# Altium schematic sheet AM-IO.SchDoc
size A
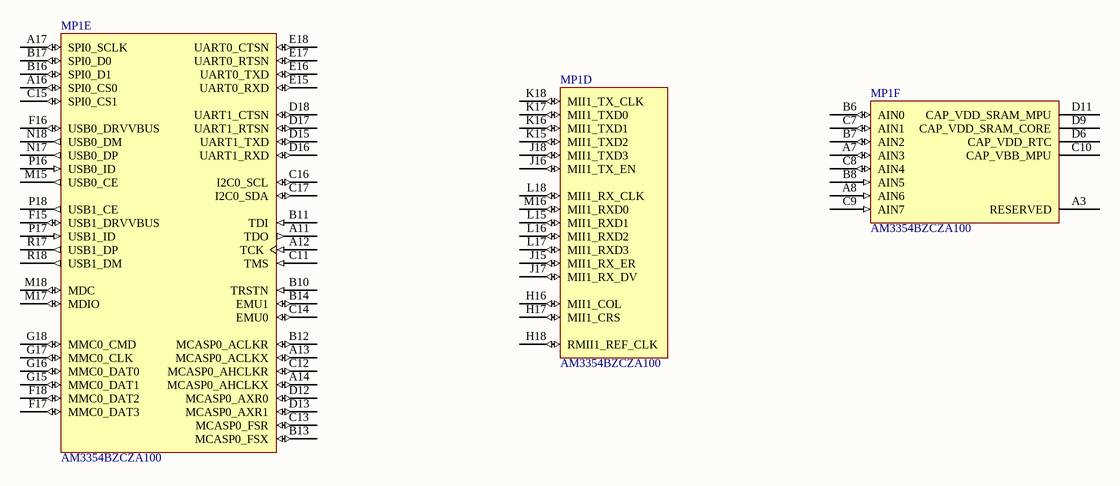
[diagram p0: AM-IO.SchDoc]

## Parts
MP1  AM3354BZCZA100  [TI-ZCZ324]  (parts D,E,F of 9)

## Nets

Not connected (* = marked no-connect by the designer): MP1 A3(RESERVED) A7(AIN3) A8(AIN6) A11(TDO) A12(TCK) A13(MCASP0_ACLKX) A14(MCASP0_AHCLKX) A16(SPI0_CS0) A17(SPI0_SCLK) B6(AIN0) B7(AIN2) B8(AIN5) B10(TRSTN) B11(TDI) B12(MCASP0_ACLKR) B13(MCASP0_FSX) B14(EMU1) B16(SPI0_D1) B17(SPI0_D0) C7(AIN1) C8(AIN4) C9(AIN7) C10(CAP_VBB_MPU) C11(TMS) C12(MCASP0_AHCLKR) C13(MCASP0_FSR) C14(EMU0) C15(SPI0_CS1) C16(I2C0_SCL) C17(I2C0_SDA) D6(CAP_VDD_RTC) D9(CAP_VDD_SRAM_CORE) D11(CAP_VDD_SRAM_MPU) D12(MCASP0_AXR0) D13(MCASP0_AXR1) D15(UART1_TXD) D16(UART1_RXD) D17(UART1_RTSN) D18(UART1_CTSN) E15(UART0_RXD) E16(UART0_TXD) E17(UART0_RTSN) E18(UART0_CTSN) F15(USB1_DRVVBUS) F16(USB0_DRVVBUS) F17(MMC0_DAT3) F18(MMC0_DAT2) G15(MMC0_DAT1) G16(MMC0_DAT0) G17(MMC0_CLK) G18(MMC0_CMD) H16(MII1_COL) H17(MII1_CRS) H18(RMII1_REF_CLK) J15(MII1_RX_ER) J16(MII1_TX_EN) J17(MII1_RX_DV) J18(MII1_TXD3) K15(MII1_TXD2) K16(MII1_TXD1) K17(MII1_TXD0) K18(MII1_TX_CLK) L15(MII1_RXD1) L16(MII1_RXD2) L17(MII1_RXD3) L18(MII1_RX_CLK) M15(USB0_CE) M16(MII1_RXD0) M17(MDIO) M18(MDC) N17(USB0_DP) N18(USB0_DM) P16(USB0_ID) P17(USB1_ID) P18(USB1_CE) R17(USB1_DP) R18(USB1_DM)

## Library data of the parts
MP1 = CMP-0547-00017-2: Sitara ARM Cortex-A8 32-Bit RISC Microprocessor, 1 GHz, SGX530 3D Graphics Engine, Programmable Real-Time Unit and Industrial Communication Subsystem (PRU-ICSS), -40 to 105 degC, 324-pin NFBGA (ZCZ), Green (RoHS & no Sb/Br); Manufacturer: Texas Instruments; eQEP: 3; CAN: 2; UART (SCI): 6; ComponentLink2Description: Datasheet; Mounting Technology: Surface Mount; ComponentLink3Description: Package Specification; Operating Temperature: -40 to 105 degC; PackageReference: ZCZ324; ComponentLink3URL: http://www.ti.com/lit/ds/symlink/am3352.pdf; ARM CPU: Cortex-A8; SPI: 2; ComponentLink2URL: http://www.ti.com/lit/ds/symlink/am3352.pdf; ComponentLink1URL: http://www.ti.com/; PackageVersion: 4211570/A; DatasheetVersion: SPRS717F; eCAP: 3; ComponentLink1Description: Manufacturer URL; PartNumber: AM3354BZCZA100; I2C: 3; PackageDescription: 324-Pin Plastic Ball Grid Array, Body 15 x 15 mm, Pitch 0.8 mm